# Altium schematic sheet Overview.SchDoc: PMPi-PCB
size A; SheetNumber: 1; SheetTotal: 6
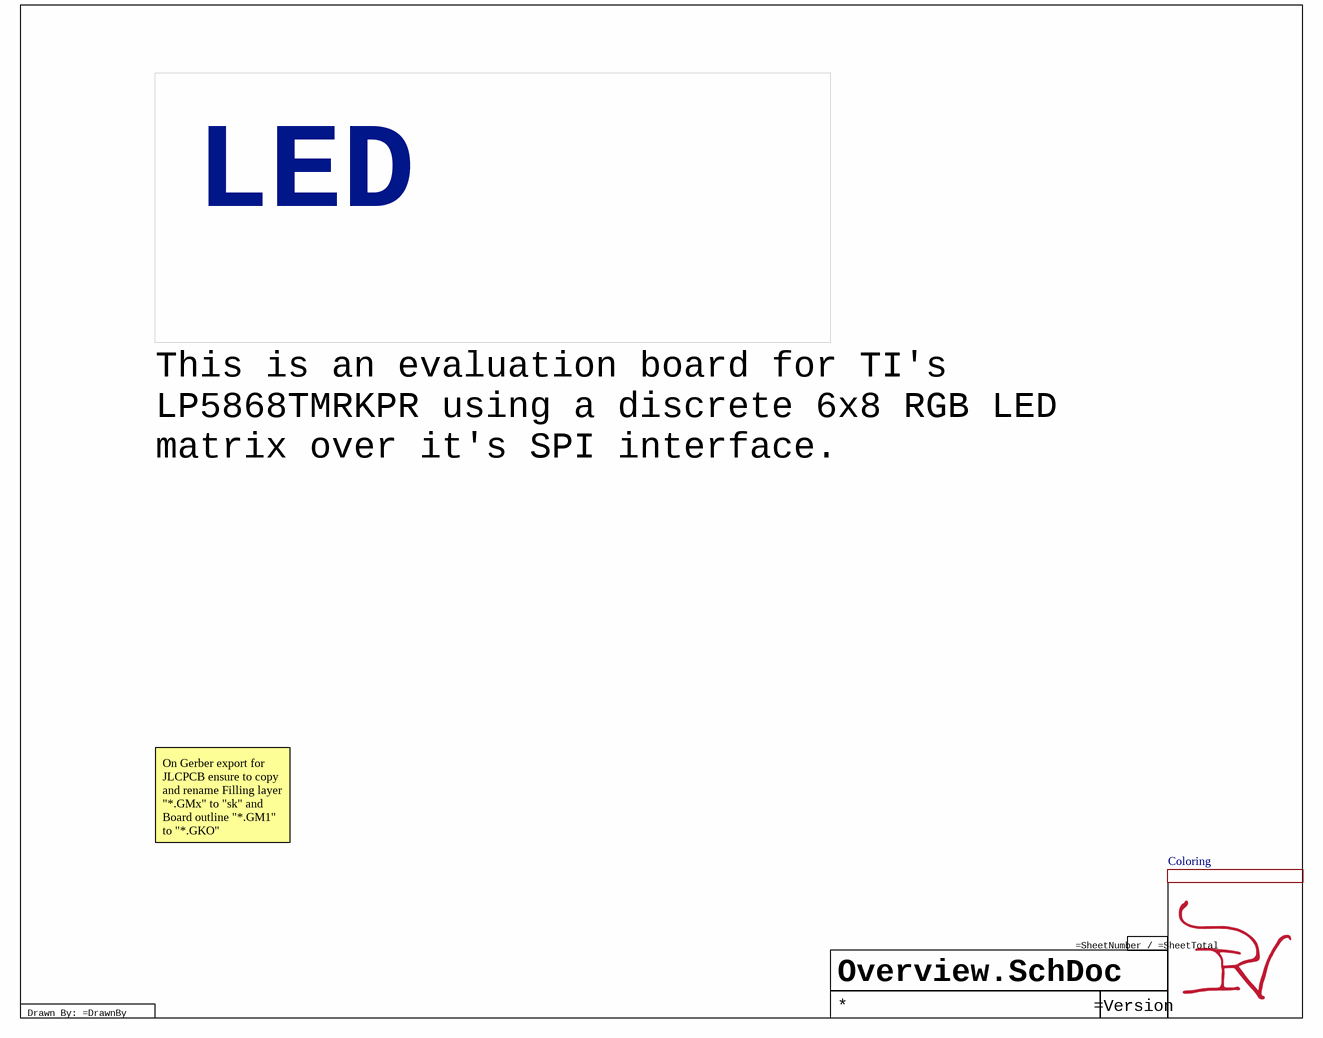
[diagram p0: Overview.SchDoc]

## Sub-sheets
Coloring = Coloring.SchDoc: no entries
LINK_ME_AND_HIDE_DESIGNATOR = LEDMatrix.SchDoc: no entries

## Notes on the sheet
- LED
- This is an evaluation board for TI's LP5868TMRKPR using a discrete 6x8 RGB LED matrix over it's SPI interface.
- On Gerber export for JLCPCB ensure to copy and rename Filling layer "*.GMx" to "sk" and Board outline "*.GM1" to "*.GKO"
- Drawn By: =DrawnBy